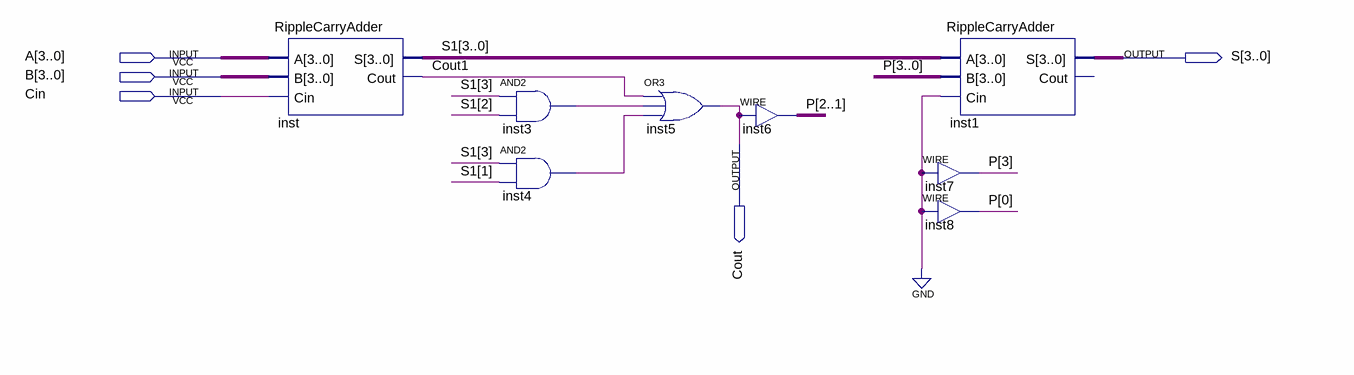
[diagram p0: schematic sheet]
// Quartus schematic BCDAdder.bdf as structural Verilog: 8 symbols, 5 pins
module BCDAdder (
  input  [3:0] A,
  input  [3:0] B,
  input  Cin,
  output [3:0] S,
  output Cout
);

  wire Cout1, inst3_out, inst4_out;
  wire [3:0] P, S1;

  RippleCarryAdder inst (.A(A), .B(B), .Cin(Cin), .S(S1), .Cout(Cout1));
  and inst3 (inst3_out, S1[3], S1[2]);
  and inst4 (inst4_out, S1[3], S1[1]);
  or inst5 (Cout, Cout1, inst3_out, inst4_out);
  assign P[2:1] = {2{Cout}};  // WIRE inst6
  RippleCarryAdder inst1 (.A(S1), .B(P), .Cin(1'b0), .S(S));  // open: Cout
  assign P[3] = 1'b0;  // WIRE inst7
  assign P[0] = 1'b0;  // WIRE inst8
endmodule
